# EAGLE schematic DAC output circuit (EAGLE 6.5.0)
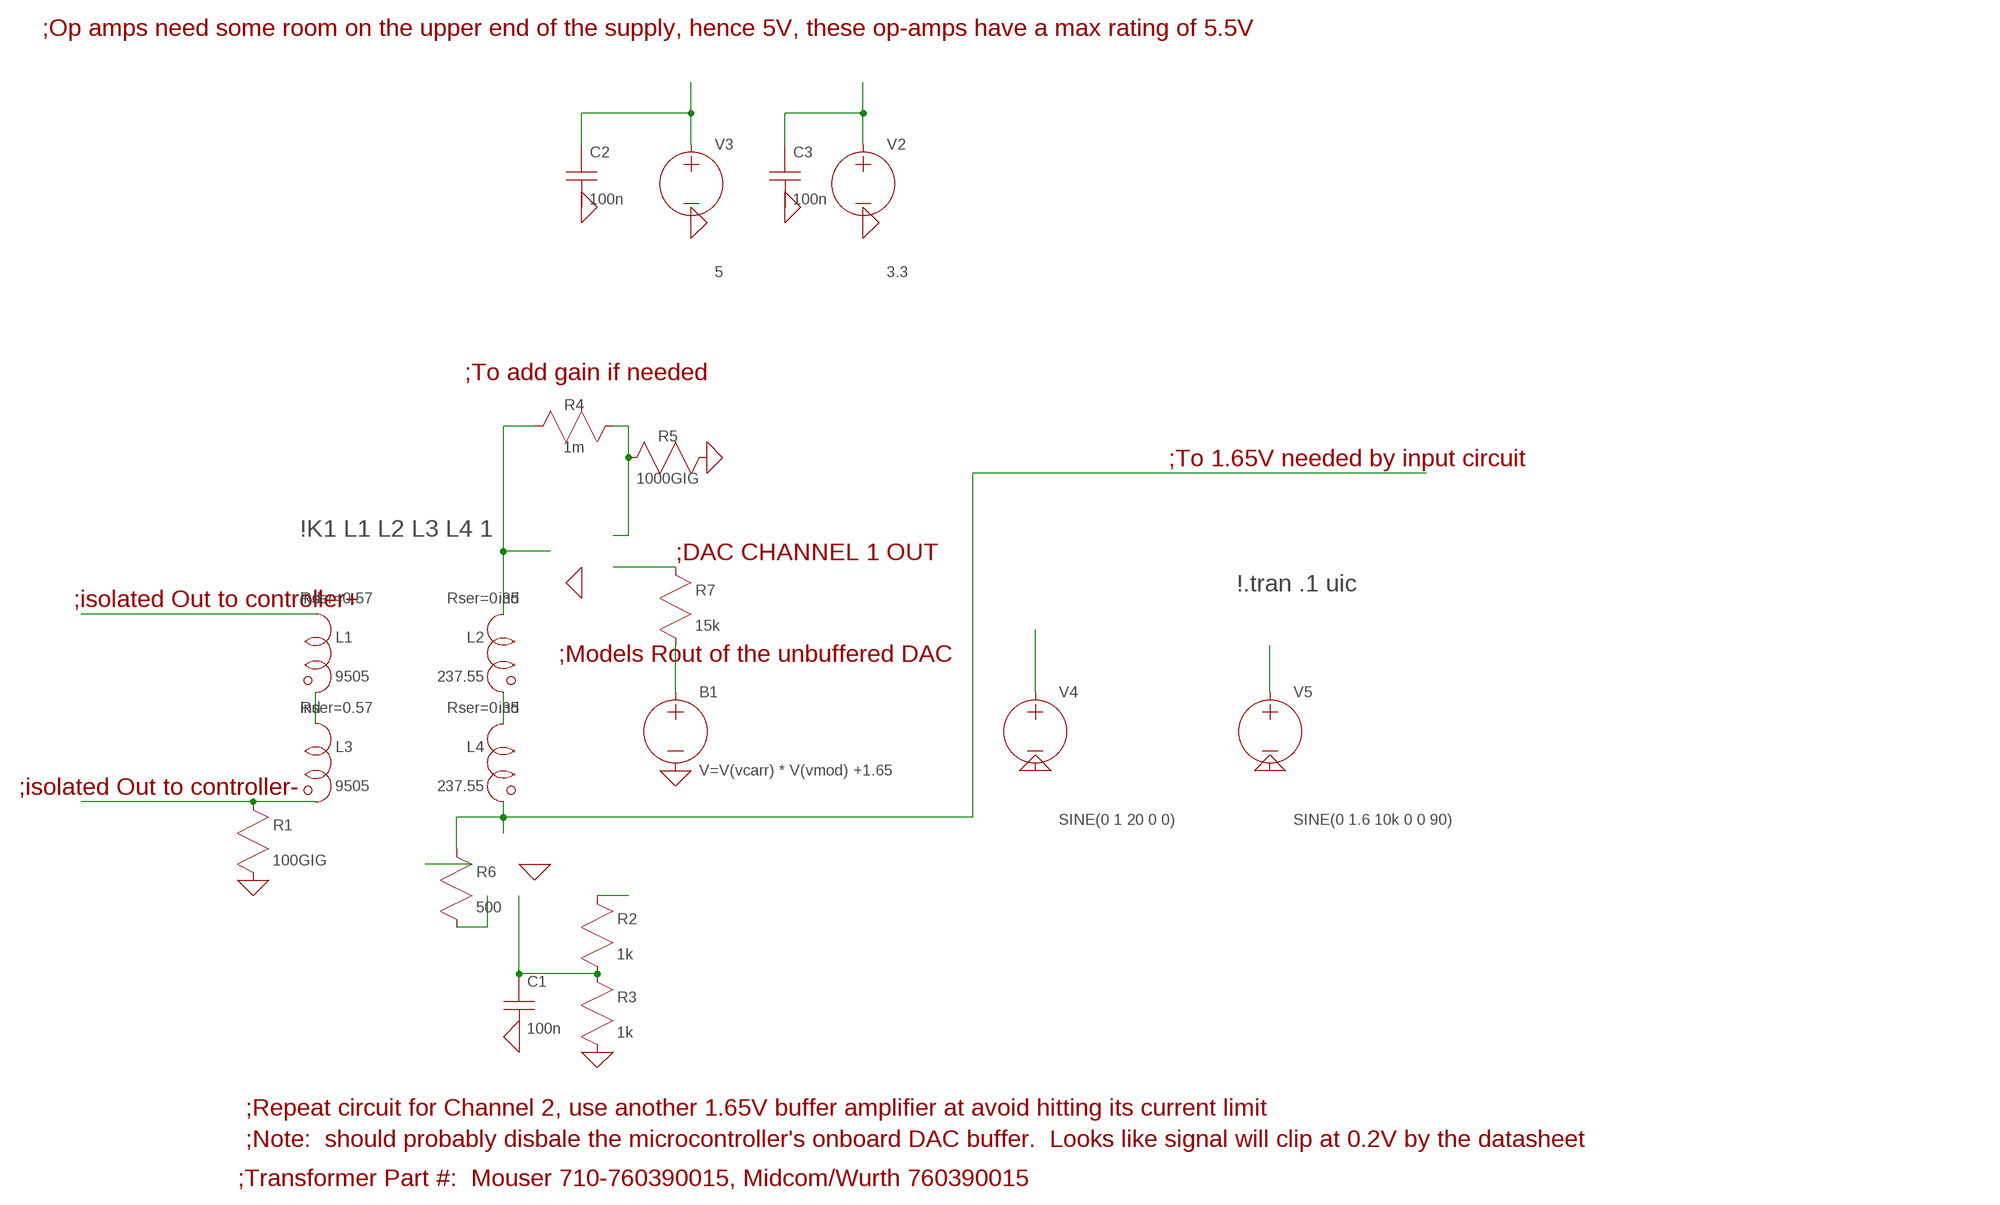
[diagram p0: schematic, sheet 1]

## Parts
B1  V=V(vcarr) * V(vmod) +1.65  BV  (no package)
C1  100n  CAP  [C0805]
C2  100n  CAP  [C0805]
C3  100n  CAP  [C0805]
L1  9505  IND2  [L1812]
L2  237.55  IND2  [L1812]
L3  9505  IND2  [L1812]
L4  237.55  IND2  [L1812]
R1  100GIG  RES  [R0805]
R2  1k  RES  [R0805]
R3  1k  RES  [R0805]
R4  1m  RES  [R0805]
R5  1000GIG  RES  [R0805]
R6  500  RES  [R0805]
R7  15k  RES  [R0805]
V2  3.3  VOLTAGE  (no package)
V3  5  VOLTAGE  (no package)
V4  SINE(0 1 20 0 0)  VOLTAGE  (no package)
V5  SINE(0 1.6 10k 0 0 90)  VOLTAGE  (no package)

## Nets
0: B1.- C1.2(B) C2.2(B) C3.2(B) R1.2(B) R3.2(B) R5.1(A) V2.- V3.- V4.- V5.-
N$1: C1.1(A) R2.2(B) R3.1(A)
N$2: C2.1(A) V3.+
N$3: C3.1(A) V2.+
N$4: L2.1(A) R4.2(B)
N$5: R4.1(A) R5.2(B)
N$6: L4.2(B) R6.1(A)
N$7: R7.1(A)
N$8: L1.1(A)
N$9: B1.+ R7.2(B)
N$10: V4.+
N$11: V5.+
N$12: L1.2(B) L3.1(A)
N$13: L2.2(B) L4.1(A)
N$14: L3.2(B) R1.1(A)
N$17: R2.1(A)
N$18: R6.2(B)

## Notes on the sheet
- ;Op amps need some room on the upper end of the supply, hence 5V, these op-amps have a max rating of 5.5V
- ;To add gain if needed
- ;To 1.65V needed by input circuit
- \!K1 L1 L2 L3 L4 1
- ;DAC CHANNEL 1 OUT
- \!.tran .1 uic
- ;isolated Out to controller+
- ;Models Rout of the unbuffered DAC
- ;isolated Out to controller-
- ;Repeat circuit for Channel 2, use another 1.65V buffer amplifier at avoid hitting its current limit
- ;Note:  should probably disbale the microcontroller's onboard DAC buffer.  Looks like signal will clip at 0.2V by the datasheet
- ;Transformer Part #:  Mouser 710-760390015, Midcom/Wurth 760390015

## Library data of the parts
B1 = lt-spice-simulation:BV: Arbitrary behavioral voltage source
C1-C3 = sym:CAP: Capacitor
L1 L3 = sym:IND2: Inductor; SPICELINE: Rser=0.57; SPICETYPE: ind
L2 L4 = sym:IND2: Inductor; SPICELINE: Rser=0.35; SPICETYPE: ind
R1-R3 R5-R7 = sym:RES: A resistor
R4 = sym:RES: A resistor; SPICELINE: Rser=1
V2-V5 = lt-spice-simulation:VOLTAGE: Voltage Source, either DC, AC, PULSE, SINE, PWL, EXP, or SFFM